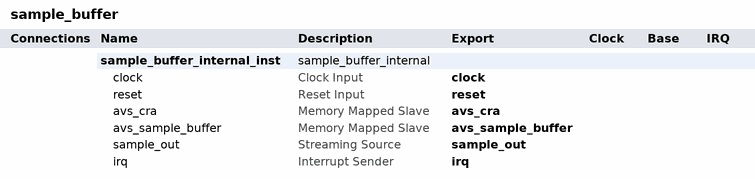
[diagram p0: system contents]
# Platform Designer (Qsys) system sample_buffer, MAX 10 10M50DAF672I7G
# Parameters at their usual value, and those the tool derives, are not listed.
package require qsys
create_system sample_buffer
set_project_property DEVICE_FAMILY {MAX 10}
set_project_property DEVICE 10M50DAF672I7G

add_instance sample_buffer_internal_inst sample_buffer_internal 1.0
set_instance_property sample_buffer_internal_inst AUTO_EXPORT true

# exported interfaces
add_interface avs_cra avalon slave
set_interface_property avs_cra EXPORT_OF sample_buffer_internal_inst.avs_cra
add_interface avs_sample_buffer avalon slave
set_interface_property avs_sample_buffer EXPORT_OF sample_buffer_internal_inst.avs_sample_buffer
add_interface clock clock sink
set_interface_property clock EXPORT_OF sample_buffer_internal_inst.clock
add_interface irq interrupt sender
set_interface_property irq EXPORT_OF sample_buffer_internal_inst.irq
add_interface reset reset sink
set_interface_property reset EXPORT_OF sample_buffer_internal_inst.reset
add_interface sample_out avalon_streaming source
set_interface_property sample_out EXPORT_OF sample_buffer_internal_inst.sample_out

set_interconnect_requirement {$system} qsys_mm.clockCrossingAdapter HANDSHAKE
set_interconnect_requirement {$system} qsys_mm.enableEccProtection FALSE
set_interconnect_requirement {$system} qsys_mm.insertDefaultSlave FALSE
set_interconnect_requirement {$system} qsys_mm.maxAdditionalLatency 1

save_system sample_buffer.qsys
